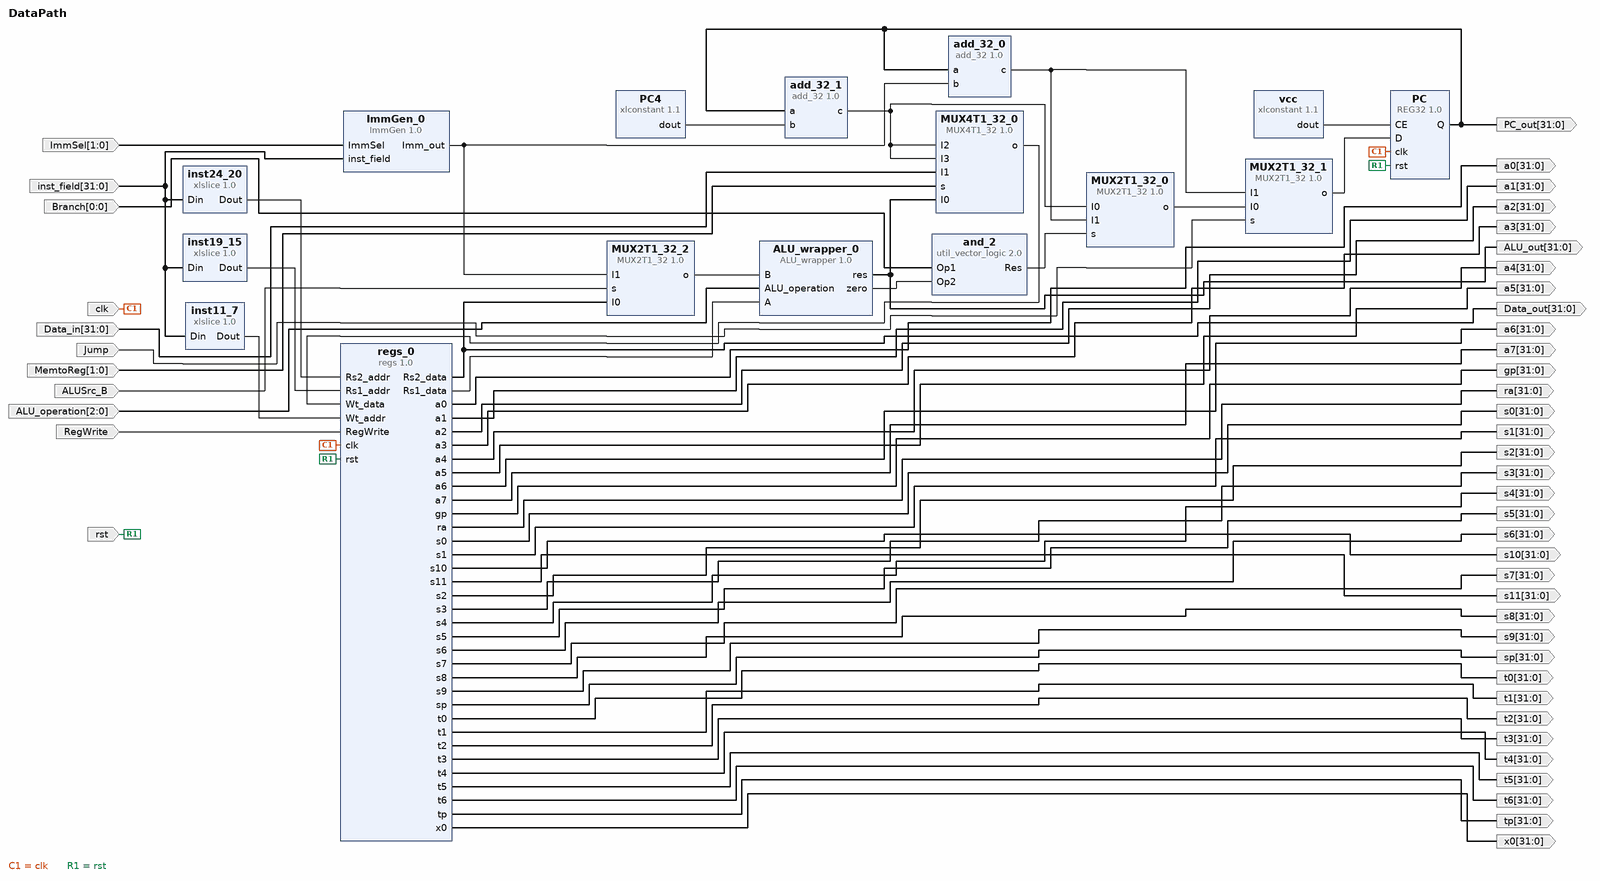
[diagram p0: block diagram of the top level]
# Vivado block design DataPath, xc7k160tffg676-2L, Vivado 2020.2
create_bd_design DataPath

create_bd_port -dir I -from 1 -to 0 ImmSel
create_bd_port -dir I -from 31 -to 0 inst_field
create_bd_port -dir I -from 0 -to 0 Branch
create_bd_port -dir I Jump
create_bd_port -dir I -from 31 -to 0 Data_in
create_bd_port -dir I -from 1 -to 0 MemtoReg
create_bd_port -dir I ALUSrc_B
create_bd_port -dir I -from 2 -to 0 ALU_operation
create_bd_port -dir I -type clk clk
create_bd_port -dir I -type rst rst
set_property -dict {CONFIG.POLARITY ACTIVE_HIGH} [get_bd_ports rst]
create_bd_port -dir O -from 31 -to 0 PC_out
create_bd_port -dir O -from 31 -to 0 Data_out
create_bd_port -dir O -from 31 -to 0 ALU_out
create_bd_port -dir I RegWrite
create_bd_port -dir O -from 31 -to 0 a0
create_bd_port -dir O -from 31 -to 0 a1
create_bd_port -dir O -from 31 -to 0 a2
create_bd_port -dir O -from 31 -to 0 a3
create_bd_port -dir O -from 31 -to 0 a4
create_bd_port -dir O -from 31 -to 0 a5
create_bd_port -dir O -from 31 -to 0 a6
create_bd_port -dir O -from 31 -to 0 a7
create_bd_port -dir O -from 31 -to 0 gp
create_bd_port -dir O -from 31 -to 0 ra
create_bd_port -dir O -from 31 -to 0 s0
create_bd_port -dir O -from 31 -to 0 s1
create_bd_port -dir O -from 31 -to 0 s10
create_bd_port -dir O -from 31 -to 0 s11
create_bd_port -dir O -from 31 -to 0 s2
create_bd_port -dir O -from 31 -to 0 s3
create_bd_port -dir O -from 31 -to 0 s4
create_bd_port -dir O -from 31 -to 0 s5
create_bd_port -dir O -from 31 -to 0 s6
create_bd_port -dir O -from 31 -to 0 s7
create_bd_port -dir O -from 31 -to 0 s8
create_bd_port -dir O -from 31 -to 0 s9
create_bd_port -dir O -from 31 -to 0 sp
create_bd_port -dir O -from 31 -to 0 t0
create_bd_port -dir O -from 31 -to 0 t1
create_bd_port -dir O -from 31 -to 0 t2
create_bd_port -dir O -from 31 -to 0 t3
create_bd_port -dir O -from 31 -to 0 t4
create_bd_port -dir O -from 31 -to 0 t5
create_bd_port -dir O -from 31 -to 0 t6
create_bd_port -dir O -from 31 -to 0 tp
create_bd_port -dir O -from 31 -to 0 x0

create_bd_cell -type ip -vlnv xilinx.com:user:ImmGen:1.0 ImmGen_0
create_bd_cell -type ip -vlnv xilinx.com:user:add_32:1.0 add_32_0
create_bd_cell -type ip -vlnv xilinx.com:user:add_32:1.0 add_32_1
create_bd_cell -type ip -vlnv xilinx.com:user:MUX2T1_32:1.0 MUX2T1_32_0
create_bd_cell -type ip -vlnv xilinx.com:user:MUX4T1_32:1.0 MUX4T1_32_0
create_bd_cell -type ip -vlnv xilinx.com:user:MUX2T1_32:1.0 MUX2T1_32_1
create_bd_cell -type ip -vlnv xilinx.com:user:MUX2T1_32:1.0 MUX2T1_32_2
create_bd_cell -type ip -vlnv xilinx.com:user:regs:1.0 regs_0
create_bd_cell -type ip -vlnv xilinx.com:user:REG32:1.0 PC
create_bd_cell -type ip -vlnv xilinx.com:user:ALU_wrapper:1.0 ALU_wrapper_0
create_bd_cell -type ip -vlnv xilinx.com:ip:util_vector_logic:2.0 and_2
set_property -dict {CONFIG.C_SIZE 1} [get_bd_cells and_2]
create_bd_cell -type ip -vlnv xilinx.com:ip:xlconstant:1.1 PC4
set_property -dict {CONFIG.CONST_VAL 4 CONFIG.CONST_WIDTH 32} [get_bd_cells PC4]
create_bd_cell -type ip -vlnv xilinx.com:ip:xlconstant:1.1 vcc
create_bd_cell -type ip -vlnv xilinx.com:ip:xlslice:1.0 inst19_15
set_property -dict {CONFIG.DIN_FROM 19 CONFIG.DIN_TO 15 CONFIG.DOUT_WIDTH 5} [get_bd_cells inst19_15]
create_bd_cell -type ip -vlnv xilinx.com:ip:xlslice:1.0 inst24_20
set_property -dict {CONFIG.DIN_FROM 24 CONFIG.DIN_TO 20 CONFIG.DOUT_WIDTH 5} [get_bd_cells inst24_20]
create_bd_cell -type ip -vlnv xilinx.com:ip:xlslice:1.0 inst11_7
set_property -dict {CONFIG.DIN_FROM 11 CONFIG.DIN_TO 7 CONFIG.DOUT_WIDTH 5} [get_bd_cells inst11_7]

# ---- connections ----

connect_bd_net -net ImmSel_0_1 [get_bd_ports ImmSel] [get_bd_pins ImmGen_0/ImmSel]
connect_bd_net -net inst_field_0_1 [get_bd_ports inst_field] \
  [get_bd_pins ImmGen_0/inst_field] [get_bd_pins inst19_15/Din] [get_bd_pins inst24_20/Din] [get_bd_pins inst11_7/Din]
connect_bd_net -net Op1_0_1 [get_bd_ports Branch] [get_bd_pins and_2/Op1]
connect_bd_net -net s_0_1 [get_bd_ports Jump] [get_bd_pins MUX2T1_32_1/s]
connect_bd_net -net I1_0_1 [get_bd_ports Data_in] [get_bd_pins MUX4T1_32_0/I1]
connect_bd_net -net s_0_2 [get_bd_ports MemtoReg] [get_bd_pins MUX4T1_32_0/s]
connect_bd_net -net s_0_3 [get_bd_ports ALUSrc_B] [get_bd_pins MUX2T1_32_2/s]
connect_bd_net -net ALU_operation_0_1 [get_bd_ports ALU_operation] [get_bd_pins ALU_wrapper_0/ALU_operation]
connect_bd_net -net clk_0_1 [get_bd_ports clk] [get_bd_pins regs_0/clk] [get_bd_pins PC/clk]
connect_bd_net -net rst_0_1 [get_bd_ports rst] [get_bd_pins regs_0/rst] [get_bd_pins PC/rst]
connect_bd_net [get_bd_pins PC4/dout] [get_bd_pins add_32_1/b]
connect_bd_net [get_bd_pins PC/Q] [get_bd_ports PC_out] [get_bd_pins add_32_1/a] [get_bd_pins add_32_0/a]
connect_bd_net [get_bd_pins regs_0/Rs2_data] [get_bd_ports Data_out] [get_bd_pins MUX2T1_32_2/I0]
connect_bd_net [get_bd_pins ALU_wrapper_0/res] [get_bd_ports ALU_out] [get_bd_pins MUX4T1_32_0/I0]
connect_bd_net [get_bd_pins ImmGen_0/Imm_out] [get_bd_pins add_32_0/b] [get_bd_pins MUX2T1_32_2/I1]
connect_bd_net [get_bd_pins ALU_wrapper_0/zero] [get_bd_pins and_2/Op2]
connect_bd_net [get_bd_pins and_2/Res] [get_bd_pins MUX2T1_32_0/s]
connect_bd_net [get_bd_pins add_32_1/c] [get_bd_pins MUX2T1_32_0/I0] [get_bd_pins MUX4T1_32_0/I2] [get_bd_pins MUX4T1_32_0/I3]
connect_bd_net [get_bd_pins add_32_0/c] [get_bd_pins MUX2T1_32_0/I1] [get_bd_pins MUX2T1_32_1/I1]
connect_bd_net [get_bd_pins MUX2T1_32_0/o] [get_bd_pins MUX2T1_32_1/I0]
connect_bd_net [get_bd_pins inst19_15/Dout] [get_bd_pins regs_0/Rs1_addr]
connect_bd_net [get_bd_pins inst24_20/Dout] [get_bd_pins regs_0/Rs2_addr]
connect_bd_net [get_bd_pins inst11_7/Dout] [get_bd_pins regs_0/Wt_addr]
connect_bd_net -net RegWrite_0_1 [get_bd_ports RegWrite] [get_bd_pins regs_0/RegWrite]
connect_bd_net [get_bd_pins MUX4T1_32_0/o] [get_bd_pins regs_0/Wt_data]
connect_bd_net [get_bd_pins vcc/dout] [get_bd_pins PC/CE]
connect_bd_net [get_bd_pins MUX2T1_32_1/o] [get_bd_pins PC/D]
connect_bd_net [get_bd_pins regs_0/Rs1_data] [get_bd_pins ALU_wrapper_0/A]
connect_bd_net [get_bd_pins MUX2T1_32_2/o] [get_bd_pins ALU_wrapper_0/B]
connect_bd_net [get_bd_pins regs_0/a0] [get_bd_ports a0]
connect_bd_net [get_bd_pins regs_0/a1] [get_bd_ports a1]
connect_bd_net [get_bd_pins regs_0/a2] [get_bd_ports a2]
connect_bd_net [get_bd_pins regs_0/a3] [get_bd_ports a3]
connect_bd_net [get_bd_pins regs_0/a4] [get_bd_ports a4]
connect_bd_net [get_bd_pins regs_0/a5] [get_bd_ports a5]
connect_bd_net [get_bd_pins regs_0/a6] [get_bd_ports a6]
connect_bd_net [get_bd_pins regs_0/a7] [get_bd_ports a7]
connect_bd_net [get_bd_pins regs_0/gp] [get_bd_ports gp]
connect_bd_net [get_bd_pins regs_0/ra] [get_bd_ports ra]
connect_bd_net [get_bd_pins regs_0/s0] [get_bd_ports s0]
connect_bd_net [get_bd_pins regs_0/s1] [get_bd_ports s1]
connect_bd_net [get_bd_pins regs_0/s10] [get_bd_ports s10]
connect_bd_net [get_bd_pins regs_0/s11] [get_bd_ports s11]
connect_bd_net [get_bd_pins regs_0/s2] [get_bd_ports s2]
connect_bd_net [get_bd_pins regs_0/s3] [get_bd_ports s3]
connect_bd_net [get_bd_pins regs_0/s4] [get_bd_ports s4]
connect_bd_net [get_bd_pins regs_0/s5] [get_bd_ports s5]
connect_bd_net [get_bd_pins regs_0/s6] [get_bd_ports s6]
connect_bd_net [get_bd_pins regs_0/s7] [get_bd_ports s7]
connect_bd_net [get_bd_pins regs_0/s8] [get_bd_ports s8]
connect_bd_net [get_bd_pins regs_0/s9] [get_bd_ports s9]
connect_bd_net [get_bd_pins regs_0/sp] [get_bd_ports sp]
connect_bd_net [get_bd_pins regs_0/t0] [get_bd_ports t0]
connect_bd_net [get_bd_pins regs_0/t1] [get_bd_ports t1]
connect_bd_net [get_bd_pins regs_0/t2] [get_bd_ports t2]
connect_bd_net [get_bd_pins regs_0/t3] [get_bd_ports t3]
connect_bd_net [get_bd_pins regs_0/t4] [get_bd_ports t4]
connect_bd_net [get_bd_pins regs_0/t5] [get_bd_ports t5]
connect_bd_net [get_bd_pins regs_0/t6] [get_bd_ports t6]
connect_bd_net [get_bd_pins regs_0/tp] [get_bd_ports tp]
connect_bd_net [get_bd_pins regs_0/x0] [get_bd_ports x0]

validate_bd_design
save_bd_design
